# EAGLE design ProtoBricks_4x4 (EAGLE 9.6.2)
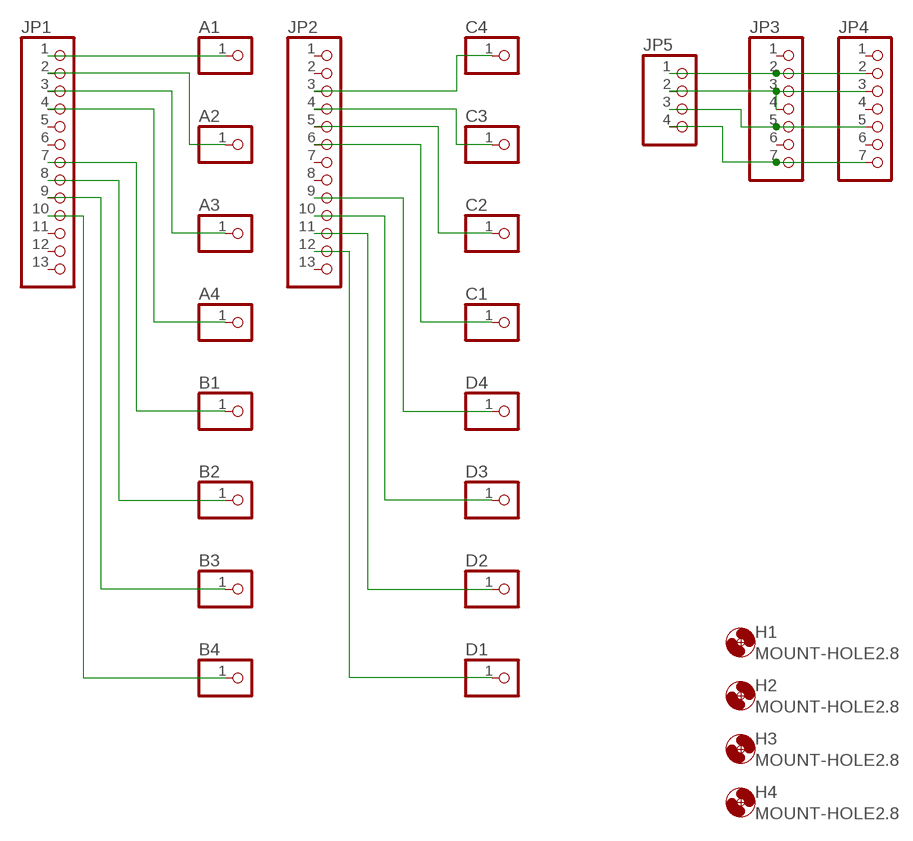
[diagram p0: schematic, sheet 1]

## Parts
A1  PINHD-1X1  [1X01]
A2  PINHD-1X1  [1X01]
A3  PINHD-1X1  [1X01]
A4  PINHD-1X1  [1X01]
B1  PINHD-1X1  [1X01]
B2  PINHD-1X1  [1X01]
B3  PINHD-1X1  [1X01]
B4  PINHD-1X1  [1X01]
C1  PINHD-1X1  [1X01]
C2  PINHD-1X1  [1X01]
C3  PINHD-1X1  [1X01]
C4  PINHD-1X1  [1X01]
D1  PINHD-1X1  [1X01]
D2  PINHD-1X1  [1X01]
D3  PINHD-1X1  [1X01]
D4  PINHD-1X1  [1X01]
H1  MOUNT-HOLE2.8  [2,8]
H2  MOUNT-HOLE2.8  [2,8]
H3  MOUNT-HOLE2.8  [2,8]
H4  MOUNT-HOLE2.8  [2,8]
JP1  PINHD-1X13  [1X13]
JP2  PINHD-1X13  [1X13]
JP3  PINHD-1X7  [1X07]
JP4  PINHD-1X7  [1X07]
JP5  PINHD-1X4  [1X04]

## Nets
GND: JP3.5 JP4.5 JP5.3
N$1: A1.1 JP1.1
N$2: A2.1 JP1.2
N$3: A3.1 JP1.3
N$4: A4.1 JP1.4
N$5: C1.1 JP2.6
N$6: B4.1 JP1.10
N$7: B3.1 JP1.9
N$8: C2.1 JP2.5
N$9: C3.1 JP2.4
N$10: C4.1 JP2.3
N$11: JP3.2 JP4.2 JP5.1
N$12: JP3.3 JP3.4 JP4.3 JP5.2
N$13: D4.1 JP2.9
N$14: D3.1 JP2.10
N$15: D2.1 JP2.11
N$16: D1.1 JP2.12
N$17: JP3.7 JP4.7 JP5.4
N$19: B1.1 JP1.7
N$20: B2.1 JP1.8
Unconnected: JP1.5 JP1.6 JP1.11 JP1.12 JP1.13 JP2.1 JP2.2 JP2.7 JP2.8 JP2.13 JP3.1 JP3.6 JP4.1 JP4.4 JP4.6

## Library data of the parts
A1-A4 B1-B4 C1-C4 D1-D4 = pinhead:PINHD-1X1: PIN HEADER
H1-H4 = holes:MOUNT-HOLE: MOUNTING HOLE with drill center marker
JP1 JP2 = pinhead:PINHD-1X13: PIN HEADER
JP3 JP4 = pinhead:PINHD-1X7: PIN HEADER
JP5 = pinhead:PINHD-1X4: PIN HEADER

## Board
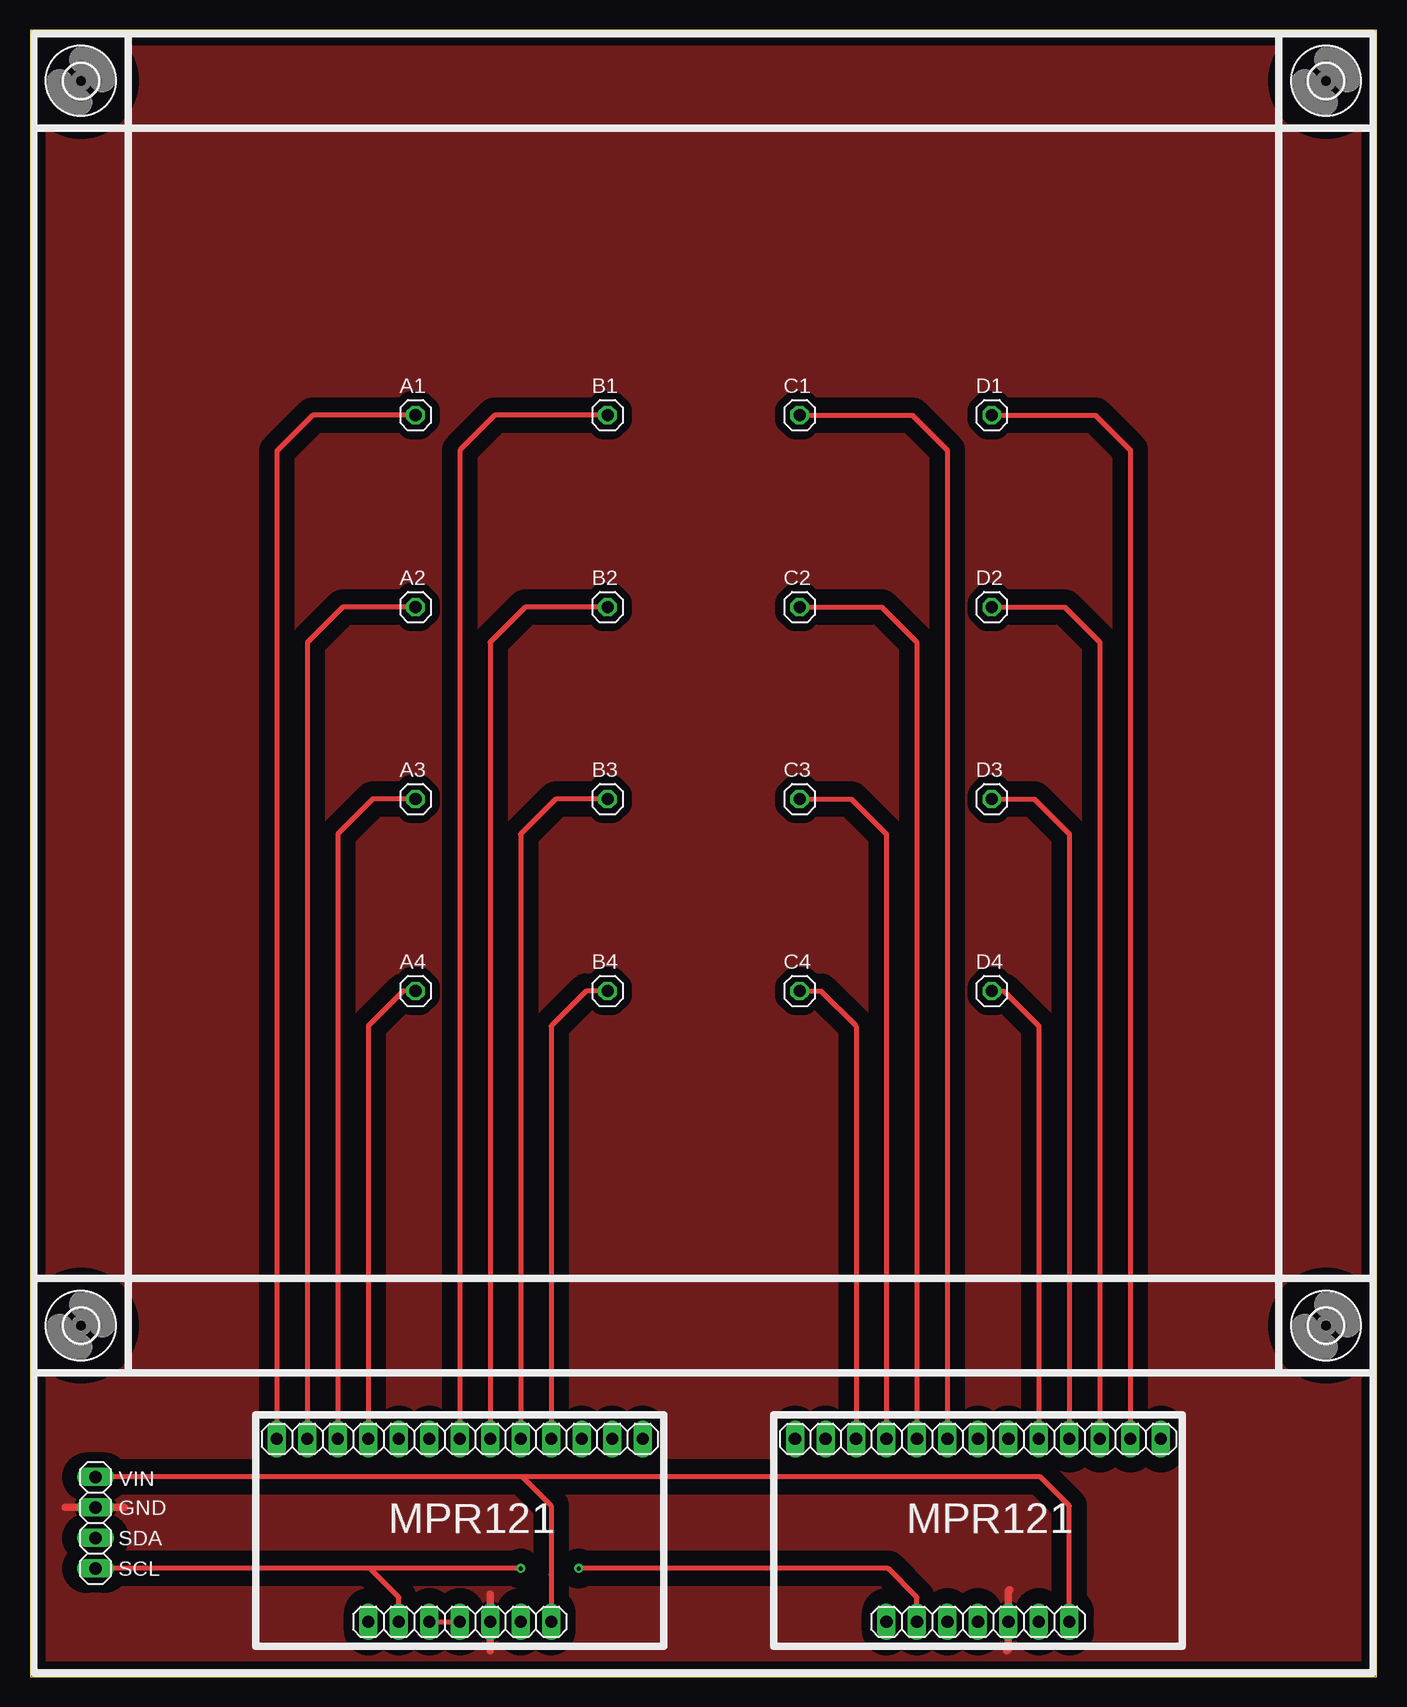
[diagram p1: board, top side]
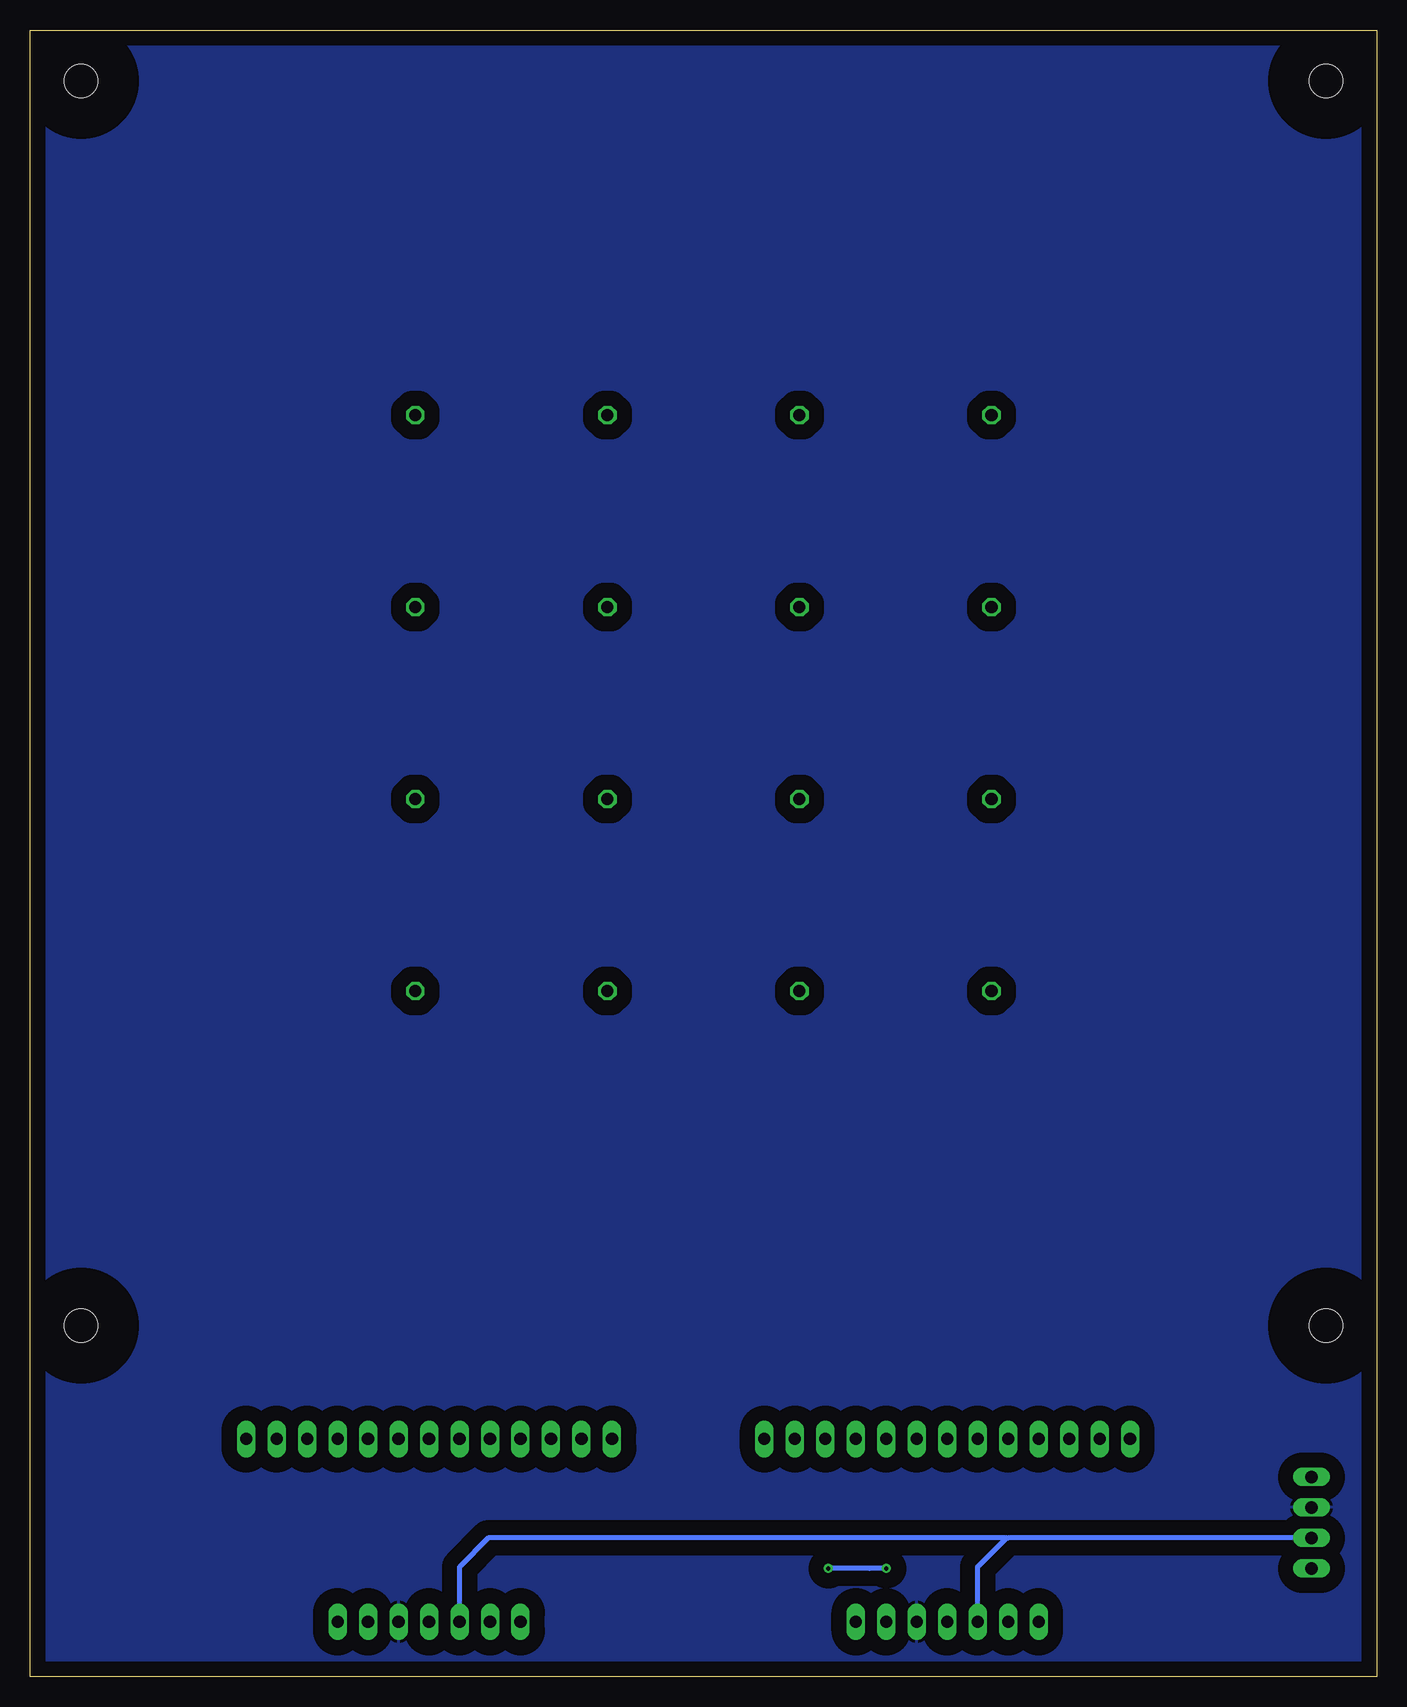
[diagram p2: board, bottom side, seen from below]

Size 112.25 x 137.26 mm. Coordinates in mm from the lower left corner, seen from the top.
Outline: 0,0 112.25,0 112.25,137.26 0,137.26 0,0
Copper layers (1*16): Top 0.035mm / dielectric 1.5mm / Bottom 0.035mm
Design rules "default": minimum track width 6mil, minimum drill 0.35mm, track to track 6mil, track to pad 6mil, pad to pad 6mil, via to via 6mil, smd to smd 6mil, copper to edge 40mil, drill to drill 6mil, minimum pad ring 10mil, minimum via ring 8mil, stop-mask expansion 4mil, vias tented up to drill 0mil, thermal gap 10mil

### Footprints (pad centres in the part's own frame; a part is rotated, then mirrored left to right if it is on the bottom)
1X01 = drill 1.016 octagon: 1 0,0
2,8 = hole 2.8: 0,0
1X13 = drill 1.016 long: 1 -15.24,0; 2 -12.7,0; 3 -10.16,0; 4 -7.62,0; 5 -5.08,0; 6 -2.54,0; 7 0,0; 8 2.54,0; 9 5.08,0; 10 7.62,0; 11 10.16,0; 12 12.7,0; 13 15.24,0
1X07 = drill 1.016 long: 1 -7.62,0; 2 -5.08,0; 3 -2.54,0; 4 0,0; 5 2.54,0; 6 5.08,0; 7 7.62,0
1X04 = drill 1.016 long: 1 -3.81,0; 2 -1.27,0; 3 1.27,0; 4 3.81,0

### Placement (x,y rotation side)
A1  32.13,105.16 0 top
A2  32.13,89.15 0 top
A3  32.13,73.15 0 top
A4  32.13,57.15 0 top
B1  48.13,105.16 0 top
B2  48.13,89.15 0 top
B3  48.13,73.15 0 top
B4  48.13,57.15 0 top
C1  64.14,105.16 0 top
C2  64.14,89.15 0 top
C3  64.14,73.15 0 top
C4  64.14,57.15 0 top
D1  80.14,105.16 0 top
D2  80.14,89.15 0 top
D3  80.14,73.15 0 top
D4  80.14,57.15 0 top
H1  4.24,29.26 0 top
H2  108,29.26 0 top
H3  4.24,133.02 0 top
H4  108,133.02 0 top
JP1  35.81,19.81 0 top
JP2  78.99,19.81 0 top
JP3  35.81,4.57 0 top
JP4  78.99,4.57 0 top
JP5  5.46,12.83 90 top

### Tracks (layer width: path | path; a pad name or v marks a point on that pad's centre or on a via)
GND
  Top 0.61: 81.66,7.24 81.53,7.11 JP4.5 81.53,2.29 81.41,2.16 | 38.35,6.86 JP3.5 38.35,2.16 | 2.92,14.1 JP5.3 7.87,14.1
  pour Bottom (isolate 1.27): 0,0 112.27,0 112.27,137.29 0,137.29
  pour Top (isolate 1.27): 0,0 112.27,0 112.27,137.29 0,137.29
N$1
  Top 0.406: A1.1 23.57,105.16 20.57,102.16 JP1.1
N$2
  Top 0.406: A2.1 26.06,89.15 23.11,86.21 JP1.2
N$3
  Top 0.406: A3.1 32.11,73.18 28.57,73.18 25.65,70.26 JP1.3
N$4
  Top 0.406: A4.1 31.09,57.15 28.19,54.25 JP1.4
N$5
  Top 0.406: C1.1 73.53,105.16 76.45,102.23 JP2.6
N$6
  Top 0.406: B4.1 46.35,57.15 43.43,54.23 JP1.10
N$7
  Top 0.406: B3.1 43.81,73.15 40.89,70.23 JP1.9
N$8
  Top 0.406: C2.1 70.99,89.15 73.91,86.23 JP2.5
N$9
  Top 0.406: C3.1 68.45,73.15 71.37,70.23 JP2.4
N$10
  Top 0.406: C4.1 65.91,57.15 68.83,54.23 JP2.3
N$11  (via drill 0.35)
  Top 0.406: JP4.2 73.91,6.6 71.5,9.02 v45.72,9.02 | v40.89,9.02 28.32,9.02 | 28.32,9.02 JP5.1 | JP3.2 30.73,6.6 28.32,9.02
  Bottom 0.406: v40.89,9.02 42.29,9.02 v45.72,9.02
N$12
  Top 0.406: JP3.3 JP3.4
  Bottom 0.406: JP3.3 33.27,9.14 30.86,11.56 | JP4.3 76.45,9.14 74.04,11.56 30.86,11.56 | JP5.2 30.73,11.56 30.86,11.56
N$13
  Top 0.406: D4.1 81.15,57.15 84.07,54.23 JP2.9
N$14
  Top 0.406: D3.1 83.69,73.15 86.61,70.23 JP2.10
N$15
  Top 0.406: D2.1 86.23,89.15 89.15,86.23 JP2.11
N$16
  Top 0.406: D1.1 88.79,105.16 91.69,102.25 JP2.12
N$17
  Top 0.406: 41.02,16.64 JP5.4 | 41.02,16.64 43.43,14.22 43.43,8.51 JP3.7 | JP4.7 86.61,14.22 84.2,16.64 41.02,16.64
N$19
  Top 0.406: B1.1 38.73,105.16 35.81,102.23 JP1.7
N$20
  Top 0.406: B2.1 41.27,89.15 38.35,86.23 JP1.8

### Text on the board
tPlace: VIN | GND | SDA | SCL
tNames: MPR121 | MPR121